# Altium project MedidorTelemetr.PrjPcb
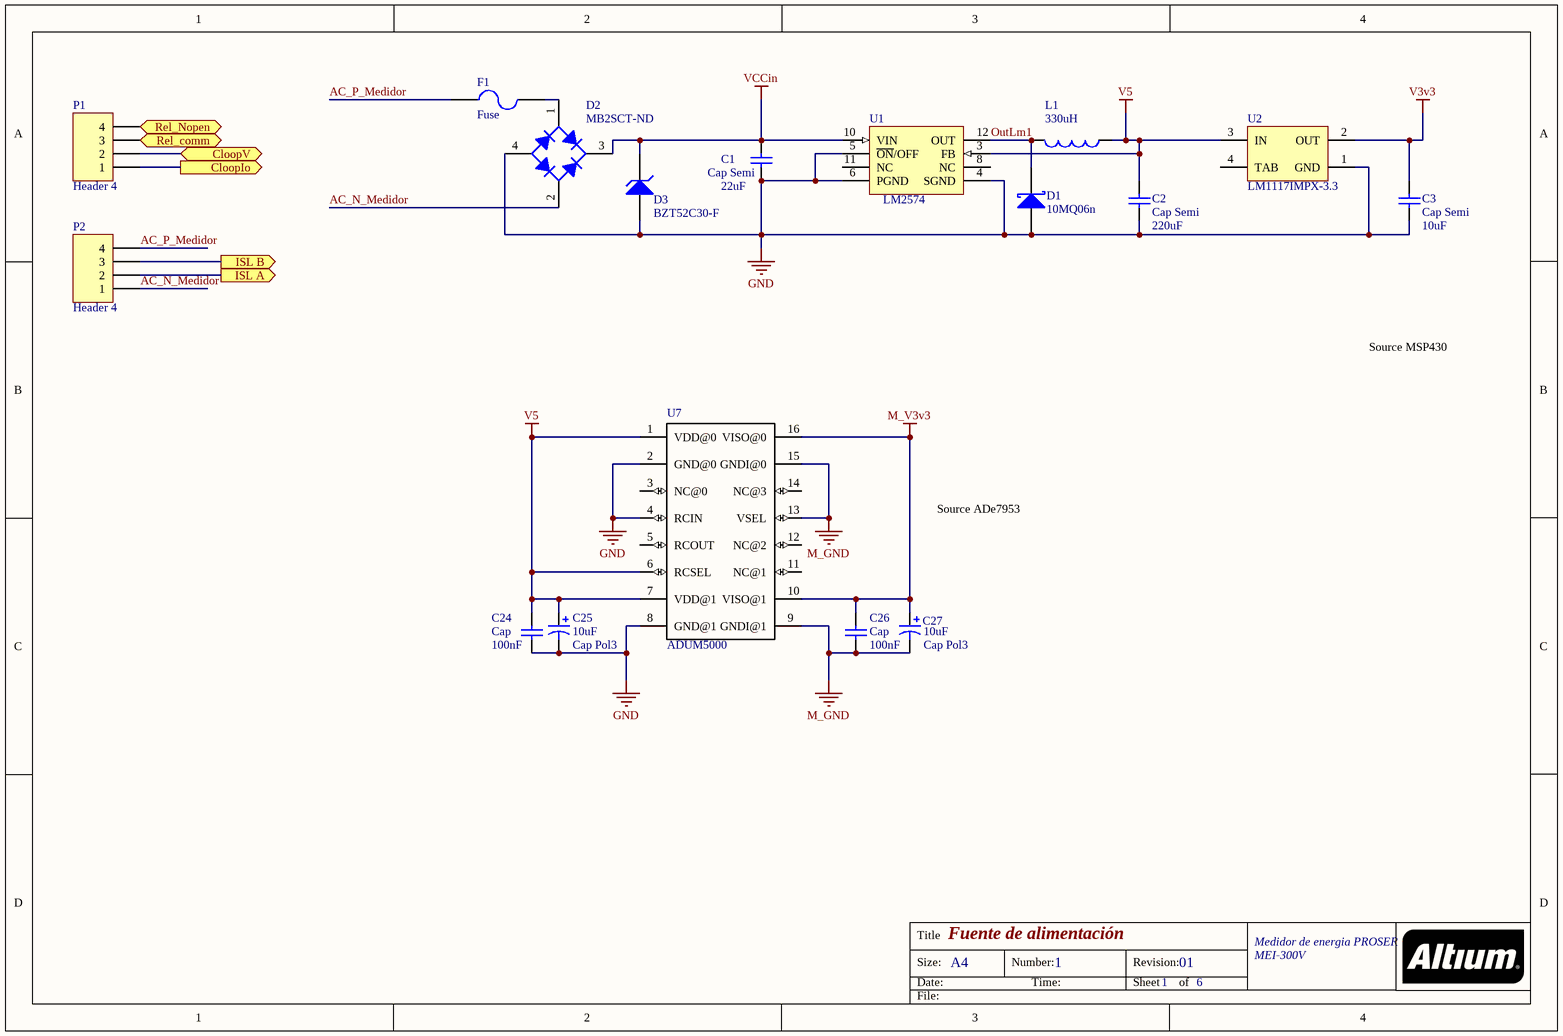
[diagram p0: Alimentacion.SchDoc]
6 sheets, 105 parts. Net scope: flat (ports and power ports of the same name join across sheets).
Board file: PCBenDIM.PcbDoc
Sheets:
  Alimentacion.SchDoc
  Micro.SchDoc
  CircuitoMedidorADE.SchDoc
  ParteAnalogicaMedicion.SchDoc
  comms.SchDoc
  Relay y salida analógica.SchDoc

## Sheet Alimentacion.SchDoc: Fuente de alimentación
size A4; Address1: Medidor de energia PROSER; Address2: MEI-300V; DocumentNumber: 1; Revision: 01; SheetNumber: 1; SheetTotal: 6

### Parts
C1  Cap Semi  value 22uF  [7343]
C2  Cap Semi  value 220uF  [7343]
C3  Cap Semi  value 10uF  [3528]
C24  Cap  value 100nF  [Custom0805]
C25  Cap Pol3  value 10uF  [3528]
C26  Cap  value 100nF  [Custom0805]
C27  Cap Pol3  value 10uF  [3528]
D1  10MQ06n  [DO214]
D2  MB2SCT-ND  [SOIC4_M]
D3  BZT52C30-F  [1N4148W]
F1  Fuse  [SMD030F]
L1  value 330uH  [PE-526XXNL]  (hidden comment: Inductor)
P1  Header 4  [ConectorPrsr]
P2  Header 4  [ConectorPrsr]
U1  LM2574  [SOIC127P1033X264-14N]
U2  LM1117IMPX-3.3  [MP04A_N]
U7  ADUM5000  [*SO16W]

### Ports
CloopIo (out), CloopV, ISL A (out), ISL B (out), Rel_comm (out), Rel_Nopen (out)

### Nets
GND: C1.1 C2.1 C3.1 C24.1 C25.2 D1.1(A) D2.4(A) D3.1(A) U1.4(SGND) U1.5(~{ON}/OFF) U1.6(PGND) U2.1(GND) U7.2(GND@0) U7.4(RCIN) U7.8(GND@1)
M_GND: C26.1 C27.2 U7.9(GNDI@1) U7.13(VSEL) U7.15(GNDI@0)
M_V3v3: C26.2 C27.1 U7.10(VISO@1) U7.16(VISO@0)
V3v3: C3.2 U2.2(OUT)
V5: C2.2 C24.2 C25.1 L1.1 U1.3(FB) U2.3(IN) U7.1(VDD@0) U7.6(RCSEL) U7.7(VDD@1)
VCCin: C1.2 D2.3(K) D3.2(K) U1.10(VIN)
AC_N_Medidor: D2.2(C) P2.1
AC_P_Medidor: F1.1 P2.4
ISL_A: P2.2 ; port ISL A
ISL_B: P2.3 ; port ISL B
OutLm1: D1.2(K) L1.2 U1.12(OUT)
Sal3: P1.2 ; port CloopV
Sal4: P1.1 ; port CloopIo
NetD2_1: D2.1(C) F1.2
NetP1_3: P1.3 ; port Rel_comm
NetP1_4: P1.4 ; port Rel_Nopen

Not connected (* = marked no-connect by the designer): U1 8(NC) 11(NC); U2 4(TAB); U7 3(NC@0) 5(RCOUT) 11(NC@1) 12(NC@2) 14(NC@3)

### Notes on the sheet
- Source MSP430
- Source ADe7953
- Title
- Size:
- Date:
- A4
- Number:
- Time:
- Revision:
- Sheet
- of
- File:

### Library data of the parts
C1-C3 = Cap Semi: Capacitor (Semiconductor SIM Model); Published: 8-Jun-2000; LatestRevisionDate: 29-May-2009; LatestRevisionNote: IPC-7351 Footprint Added.; PackageReference: C1206; Publisher: Altium Limited; PackageDescription: Chip Capacitor
C24 C26 = Cap: Capacitor; Published: 8-Jun-2000; LatestRevisionDate: 17-Jul-2002; LatestRevisionNote: Re-released for DXP Platform.; PackageReference: RAD-0.3; Publisher: Altium Limited; PackageDescription: Radial Cap, Thru-Hole; 2 Leads; 0.3 in Pin Spacing
C25 C27 = Cap Pol3: Polarized Capacitor (Surface Mount); Published: 8-Jun-2000; LatestRevisionDate: 29-May-2009; LatestRevisionNote: IPC-7351 Footprint Added.; PackageReference: C0805; Publisher: Altium Limited; PackageDescription: Chip Capacitor
D1 = D Schottky: Schottky Diode; Published: 8-Jun-2000; LatestRevisionDate: 17-Jul-2002; LatestRevisionNote: Re-released for DXP Platform.; PackageReference: SMB; Publisher: Altium Limited; PackageDescription: DO-214-AA/SMB; 2 C-Bend Leads; Body 5.3 x 3.6 mm, inc. leads (LxW); Code_JEDEC: DO-214-AA
D2 = Bridge1: Full Wave Diode Bridge - MB2S; Published: 8-Jun-2000; LatestRevisionDate: 29-May-2009; LatestRevisionNote: Sch pins A & K swapped.; DatasheetVersion: E2732B; PackageReference: D-38; Publisher: Altium Limited; PackageDescription: Bridge Rectifier; 4 Terminals; Body 9.4 x 9.4 mm (typ); Pitch 5.08 mm
D3 = D Zener: Zener Diode SMD; Published: 8-Jun-2000; LatestRevisionDate: 17-Jul-2002; LatestRevisionNote: Re-released for DXP Platform.; PackageReference: DIODE-0.7; Publisher: Altium Limited; PackageDescription: Diode, Thru-Hole; 2 Leads; 0.7 in Pin Spacing
F1 = Fuse 2: SMD030-2CT-ND; Published: 8-Jun-2000; LatestRevisionDate: 17-Jul-2002; LatestRevisionNote: Re-released for DXP Platform.; PackageReference: PIN-W2/E2.8; Publisher: Altium Limited; PackageDescription: Thru-Hole; 2 Leads
L1 = Inductor: PE52627NL; Code_IEC: 1005; Published: 8-Jun-2000; LatestRevisionDate: 29-May-2009; LatestRevisionNote: IPC-7351 Footprint Added.; PackageReference: 0402-A; Publisher: Altium Limited; PackageDescription: Chip Inductor; Code_JEITA: 0402
P1 P2 = Header 4: Header, 4-Pin; LatestRevisionDate: 17-Jul-2002; LatestRevisionNote: Re-released for DXP Platform.; Publisher: Altium Limited
U1 = LM2574N-5: Easy Switcher 0.5A Step-Down Voltage Regulator; Published: 15-Apr-2002; DatasheetVersion: Jul-1999; PackageVersion: 1998; PackageReference: 626-05; Publisher: Altium Limited; PackageDescription: DIP; 8 Leads; Row Spacing 7.62 mm; Pitch 2.54 mm; ComponentLink1Description: Manufacturer Link; ComponentLink1URL: http://www.onsemi.com/site/products/taxonomy/0,4438,503,00.html; ComponentLink2Description: Datasheet; ComponentLink2URL: http://www.onsemi.com/pub/Collateral/LM2574-D.PDF
U2 = LM1117IMPX-3.3: 800mA Low-Dropout Linear Regulator, 4-pin SOT-223; Manufacturer: National Semiconductor; PackageTopMarking: XYTT*N05B; PowerWise: N; CompType: LDO IC; Published: 1-Mar-2010; DatasheetVersion: Apr-2006; PackageVersion: revB, Apr-2003; PackageReference: MP04A; Publisher: Altium Limited; PackageDescription: Molded SOT-223, 6.50 x 3.56 x 1.6mm Body, 4 Lead, 2.3mm Pitch; PartNumber: LM1117IMPX-3.3; RoHS: N; PinCount: 4; Code_JEDEC: TO-261-AA; Code_IPC: SOT223-4; ComponentLink1Description: LM1117 Datasheet; ComponentLink1URL: http://www.national.com/ds/LM/LM1117.pdf; ComponentLink2Description: LM1117 Web Page; ComponentLink2URL: http://www.national.com/pf/LM/LM1117.html; ComponentLink3Description: MP04A Package Page; ComponentLink3URL: http://www.national.com/packaging/folders/mp04a.html
U7 = ADUM5000: ADI Isolated DC/DC Converter; MF: Analog Devices; SnapEDA_Link: https://www.snapeda.com/parts/ADUM5000/Analog%20Devices%20Inc./view-part/?ref=snap; Price: None; Availability: Unavailable; MP: ADUM5000; Package: None; Value: *

## Sheet Micro.SchDoc: Microcontrolador MSP430F2618
size A4; Address1: Medidor de energia PROSER; Address2: MEI-300V; DocumentNumber: 2; Revision: 01; SheetNumber: 2; SheetTotal: 6
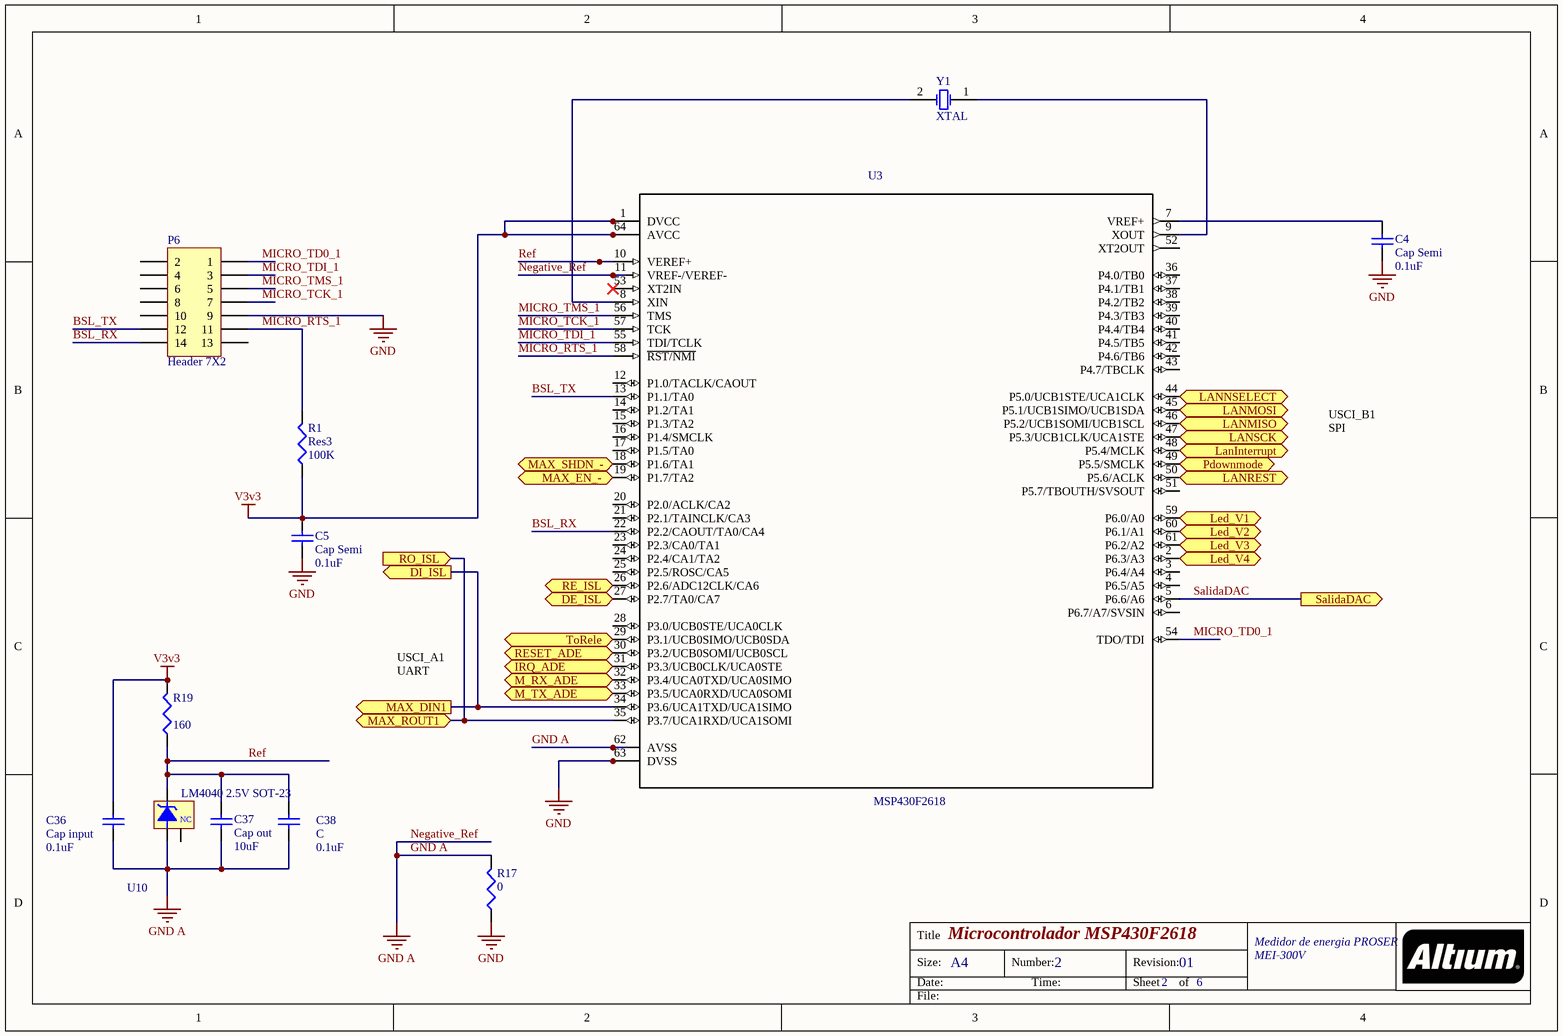
[diagram p1: Micro.SchDoc]

### Parts
C4  Cap Semi  value 0.1uF  [Custom0805]
C5  Cap Semi  value 0.1uF  [Custom0805]
C36  Cap input  value 0.1uF  [CUSTOM0805]
C37  Cap out  value 10uF  [TC6032-2412]
C38  C  value 0.1uF  [Custom0805]
P6  Header 7X2  [HDR2X7]
R1  Res3  value 100K  [Custom0805]
R17  value 0  [Custom0805]  (hidden comment: Res3)
R19  value 160  [Custom0805]  (hidden comment: Res3)
U3  MSP430F2618  [QFP50P1200X1200X160-64N]
U10  LM4040 2.5V SOT-23  [SOT23_M]
Y1  XTAL  [XTAL1140X475X430D1315L440X63M]

### Ports
DE_ISL (out), DI_ISL (out), IRQ_ADE (in), LanInterrupt (in), LANMISO (in), LANMOSI (out), LANNSELECT (out), LANREST (out), LANSCK (out), Led_V1 (out), Led_V2 (out), Led_V3 (out), Led_V4 (out), M_RX_ADE (out), M_TX_ADE (in), MAX_DIN1 (out), MAX_EN_- (out), MAX_ROUT1, MAX_SHDN_- (out), Pdownmode (out), RE_ISL (out), RESET_ADE (out), RO_ISL (in), SalidaDAC (out), ToRele (out)

### Nets
GND: C4.1 C5.1 P6.9 R17.1 U3.63(DVSS)
GND A: C36.1 C37.1 C38.1 R17.2 U3.11(VREF-/VEREF-) U3.62(AVSS) U10.2(A)  [also labelled Negative_Ref]
V3v3: C5.2 C36.2 R1.1 R19.2 U3.1(DVCC) U3.64(AVCC)
BSL_RX: P6.14 U3.22(P2.2/CAOUT/TA0/CA4)
BSL_TX: P6.12 U3.13(P1.1/TA0)
MICRO_RTS_1: P6.11 R1.2 U3.58(~{RST/NMI})
MICRO_TCK_1: P6.7 U3.57(TCK)
MICRO_TD0_1: P6.1 U3.54(TDO/TDI)
MICRO_TDI_1: P6.3 U3.55(TDI/TCLK)
MICRO_TMS_1: P6.5 U3.56(TMS)
Ref: C37.2 C38.2 R19.1 U3.10(VEREF+) U10.1(K)
SalidaDAC: U3.5(P6.6/A6) ; port SalidaDAC
NetC4_2: C4.2 U3.7(VREF+)
NetEth1_3: U3.45(P5.1/UCB1SIMO/UCB1SDA) ; port LANMOSI
NetEth1_4: U3.47(P5.3/UCB1CLK/UCA1STE) ; port LANSCK
NetEth1_5: U3.44(P5.0/UCB1STE/UCA1CLK) ; port LANNSELECT
NetEth1_6: U3.48(P5.4/MCLK) ; port LanInterrupt
NetEth1_10: U3.49(P5.5/SMCLK) ; port Pdownmode
NetEth1_11: U3.50(P5.6/ACLK) ; port LANREST
NetEth1_12: U3.46(P5.2/UCB1SOMI/UCB1SCL) ; port LANMISO
NetR3_2: U3.35(P3.7/UCA1RXD/UCA1SOMI) ; port RO_ISL, port MAX_ROUT1
NetR22_1: U3.29(P3.1/UCB0SIMO/UCB0SDA) ; port ToRele
NetU3_2: U3.2(P6.3/A3) ; port Led_V4
NetU3_8: U3.8(XIN) Y1.2(OSC2)
NetU3_9: U3.9(XOUT) Y1.1(OSC1)
NetU3_18: U3.18(P1.6/TA1) ; port MAX_SHDN_-
NetU3_19: U3.19(P1.7/TA2) ; port MAX_EN_-
NetU3_26: U3.26(P2.6/ADC12CLK/CA6) ; port RE_ISL
NetU3_27: U3.27(P2.7/TA0/CA7) ; port DE_ISL
NetU3_30: U3.30(P3.2/UCB0SOMI/UCB0SCL) ; port RESET_ADE
NetU3_31: U3.31(P3.3/UCB0CLK/UCA0STE) ; port IRQ_ADE
NetU3_32: U3.32(P3.4/UCA0TXD/UCA0SIMO) ; port M_RX_ADE
NetU3_33: U3.33(P3.5/UCA0RXD/UCA0SOMI) ; port M_TX_ADE
NetU3_34: U3.34(P3.6/UCA1TXD/UCA1SIMO) ; port DI_ISL, port MAX_DIN1
NetU3_59: U3.59(P6.0/A0) ; port Led_V1
NetU3_60: U3.60(P6.1/A1) ; port Led_V2
NetU3_61: U3.61(P6.2/A2) ; port Led_V3

Not connected (* = marked no-connect by the designer): P6 2 4 6 8 10 13; U3 3(P6.4/A4) 4(P6.5/A5) 6(P6.7/A7/SVSIN) 12(P1.0/TACLK/CAOUT) 14(P1.2/TA1) 15(P1.3/TA2) 16(P1.4/SMCLK) 17(P1.5/TA0) 20(P2.0/ACLK/CA2) 21(P2.1/TAINCLK/CA3) 23(P2.3/CA0/TA1) 24(P2.4/CA1/TA2) 25(P2.5/ROSC/CA5) 28(P3.0/UCB0STE/UCA0CLK) 36(P4.0/TB0) 37(P4.1/TB1) 38(P4.2/TB2) 39(P4.3/TB3) 40(P4.4/TB4) 41(P4.5/TB5) 42(P4.6/TB6) 43(P4.7/TBCLK) 51(P5.7/TBOUTH/SVSOUT) 52(XT2OUT) 53(XT2IN)*; U10 3(NC)

### Notes on the sheet
- USCI_B1
  SPI
- USCI_A1
  UART
- Title
- Size:
- Date:
- A4
- Number:
- Time:
- Revision:
- Sheet
- of
- File:

### Library data of the parts
C4 C5 C36-C38 = Cap Semi: Capacitor (Semiconductor SIM Model); Published: 8-Jun-2000; LatestRevisionDate: 29-May-2009; LatestRevisionNote: IPC-7351 Footprint Added.; PackageReference: C1206; Publisher: Altium Limited; PackageDescription: Chip Capacitor
P6 = Header 7X2: Header, 7-Pin, Dual row; LatestRevisionDate: 17-Jul-2002; LatestRevisionNote: Re-released for DXP Platform.; Publisher: Altium Limited
R1 R17 R19 = Res3: Resistor; Published: 8-Jun-2000; LatestRevisionDate: 29-May-2009; LatestRevisionNote: IPC-7351 Footprint Added.; PackageReference: J1-0603; Publisher: Altium Limited; PackageDescription: Chip Resistor
U3 = MSP430F2410TPMR: 16-bit Ultra-Low-Power Microcontroller, 56KB Flash, 4KB RAM, 12-Bit ADC, 2 USCIs, HW Multiplier 64-LQFP -40 to 105; MF: Texas Instruments; Package: LQFP-64 Texas Instruments; Price: None; SnapEDA_Link: https://www.snapeda.com/parts/MSP430F2410TPMR/Texas%20Instruments/view-part/?ref=snap; Availability: Unavailable; MP: MSP430F2410TPMR; Value: *
U10 = LM185LD-2.5: Micropower Voltage Reference; Note: Anode (pin 3) is in electrical contact with the case.; Published: 15-Apr-2002; DatasheetVersion: Jan-1989; PackageVersion: 1989; PackageReference: LD003; Publisher: Altium Limited; PackageDescription: Can; 3 Leads; Pin Circle Dia. 2.54 mm; Lead Dia. 0.48 mm (max); ComponentLink1Description: Manufacturer Link; ComponentLink1URL: http://www.ti.com/
Y1 = XTAL: Crystal Oscillator; Published: 8-Jun-2000; LatestRevisionDate: 17-Jul-2002; LatestRevisionNote: Re-released for DXP Platform.; PackageReference: R38; Publisher: Altium Limited; PackageDescription: Crystal, Thru-Hole; 2 Leads; Body 3.1 x 8.2 mm (Dia.xH)

## Sheet CircuitoMedidorADE.SchDoc: ADE7953
size A4; Address1: Medidor de energia PROSER; Address2: MEI-300V; DocumentNumber: 3; Revision: 01; SheetNumber: 3; SheetTotal: 6
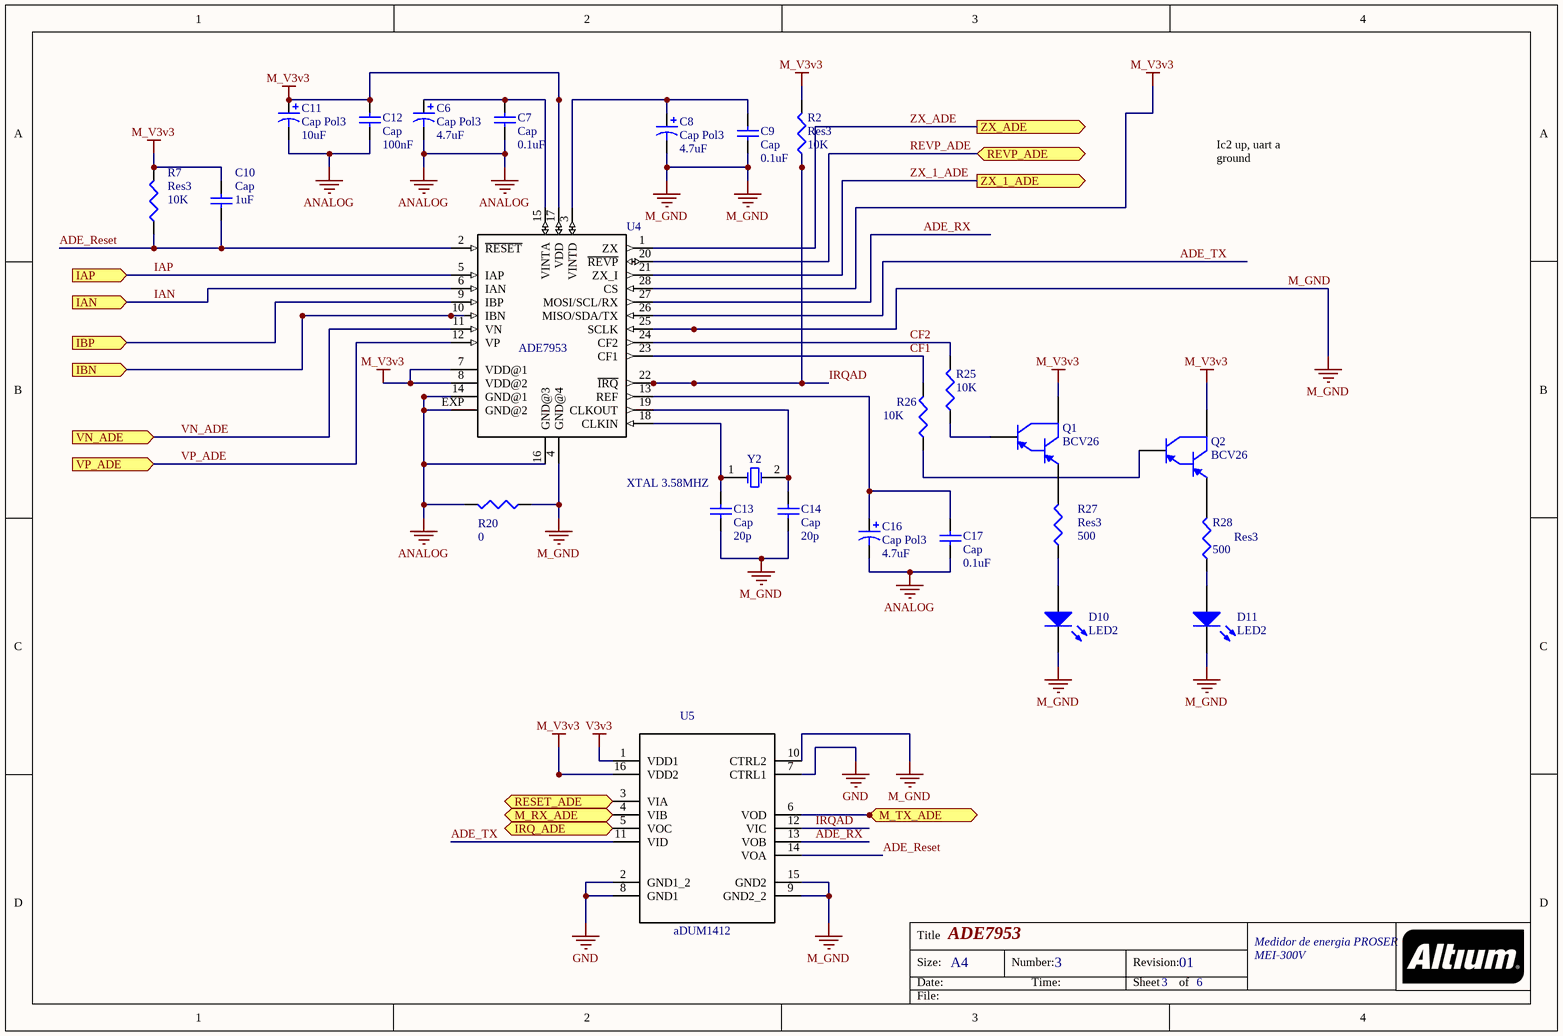
[diagram p2: CircuitoMedidorADE.SchDoc]

### Parts
C6  Cap Pol3  value 4.7uF  [Custom0805]
C7  Cap  value 0.1uF  [Custom0805]
C8  Cap Pol3  value 4.7uF  [Custom0805]
C9  Cap  value 0.1uF  [Custom0805]
C10  Cap  value 1uF  [Custom0805]
C11  Cap Pol3  value 10uF  [Custom0805]
C12  Cap  value 100nF  [Custom0805]
C13  Cap  value 20p  [Custom0805]
C14  Cap  value 20p  [Custom0805]
C16  Cap Pol3  value 4.7uF  [Custom0805]
C17  Cap  value 0.1uF  [Custom0805]
D10  LED2  [Custom0805]
D11  LED2  [Custom0805]
Q1  BCV26  [SOT23_L]
Q2  BCV26  [SOT23_L]
R2  Res3  value 10K  [Custom0805]
R7  Res3  value 10K  [Custom0805]
R20  value 0  [Custom0805]  (hidden comment: Res3)
R25  value 10K  [Custom0805]  (hidden comment: Rb)
R26  value 10K  [Custom0805]  (hidden comment: Rb)
R27  Res3  value 500  [Custom0805]
R28  Res3  value 500  [Custom0805]
U4  ADE7953  [*LFCSP28_ADE7953(Primary)]
U5  aDUM1412  [*SOIC127P1032X265-16N]
Y2  XTAL 3.58MHZ  [XTAL1140X475X430D1315L440X63M]

### Ports
IAN (in), IAP (in), IBN (in), IBP (in), IRQ_ADE (out), M_RX_ADE (in), M_TX_ADE (out), RESET_ADE (in), REVP_ADE (bidir), VN_ADE (in), VP_ADE (in), ZX_1_ADE (out), ZX_ADE (out)

### Nets
ANALOG: C6.2 C7.1 C11.2 C12.1 C16.2 C17.1 R20.2 U4.14(GND@1) U4.16(GND@3) U4.EXP(GND@2)
GND: U5.2(GND1_2) U5.7(CTRL1) U5.8(GND1)
M_GND: C8.2 C9.1 C13.1 C14.1 D10.2(K) D11.2(K) R20.1 U4.4(GND@4) U4.25(SCLK) U5.9(GND2_2) U5.10(CTRL2) U5.15(GND2)
M_V3v3: C10.2 C11.1 C12.2 Q1.3(C) Q2.3(C) R2.2 R7.2 U4.7(VDD@1) U4.8(VDD@2) U4.17(VDD) U4.28(CS) U5.16(VDD2)
V3v3: U5.1(VDD1)
ADE_Reset: C10.1 R7.1 U4.2(~{RESET}) U5.14(VOA)
ADE_RX: U4.27(MOSI/SCL/RX) U5.13(VOB)
ADE_TX: U4.26(MISO/SDA/TX) U5.11(VID)
CF1: R26.2 U4.23(CF1)
CF2: R25.2 U4.24(CF2)
IAN: U4.6(IAN) ; port IAN
IAP: U4.5(IAP) ; port IAP
IRQAD: R2.1 U4.22(~{IRQ}) U5.12(VIC)
REVP_ADE: U4.20(~{REVP}) ; port REVP_ADE
VN_ADE: U4.11(VN) ; port VN_ADE
VP_ADE: U4.12(VP) ; port VP_ADE
ZX_1_ADE: U4.21(ZX_I) ; port ZX_1_ADE
ZX_ADE: U4.1(ZX) ; port ZX_ADE
NetC6_1: C6.1 C7.2 U4.15(VINTA)
NetC8_1: C8.1 C9.2 U4.3(VINTD)
NetC13_2: C13.2 U4.18(CLKIN) Y2.1(OSC1)
NetC14_2: C14.2 U4.19(CLKOUT) Y2.2(OSC2)
NetC16_1: C16.1 C17.2 U4.13(REF)
NetD10_1: D10.1(A) R27.1
NetD11_1: D11.1(A) R28.1
NetQ1_1: Q1.1(E) R27.2
NetQ1_2: Q1.2(B) R25.1
NetQ2_1: Q2.1(E) R28.2
NetQ2_2: Q2.2(B) R26.1
NetU3_30: U5.3(VIA) ; port RESET_ADE
NetU3_31: U5.5(VOC) ; port IRQ_ADE
NetU3_32: U5.4(VIB) ; port M_RX_ADE
NetU3_33: U5.6(VOD) ; port M_TX_ADE
NetU4_9: U4.9(IBP) ; port IBP
NetU4_10: U4.10(IBN) ; port IBN

### Notes on the sheet
- Ic2 up, uart a ground
- Title
- Size:
- Date:
- A4
- Number:
- Time:
- Revision:
- Sheet
- of
- File:

### Library data of the parts
C6 C8 C11 C16 = Cap Pol3: Polarized Capacitor (Surface Mount); Published: 8-Jun-2000; LatestRevisionDate: 29-May-2009; LatestRevisionNote: IPC-7351 Footprint Added.; PackageReference: C0805; Publisher: Altium Limited; PackageDescription: Chip Capacitor
C7 C9 C10 C12-C14 C17 = Cap: Capacitor; Published: 8-Jun-2000; LatestRevisionDate: 17-Jul-2002; LatestRevisionNote: Re-released for DXP Platform.; PackageReference: RAD-0.3; Publisher: Altium Limited; PackageDescription: Radial Cap, Thru-Hole; 2 Leads; 0.3 in Pin Spacing
D10 D11 = LED2: Typical RED, GREEN, YELLOW, AMBER GaAs LED; Published: 8-Jun-2000; LatestRevisionDate: 17-Jul-2002; LatestRevisionNote: Re-released for DXP Platform.; PackageVersion: Feb-2002; PackageReference: 3.2X1.6X1.1; Publisher: Altium Limited; PackageDescription: SM LED; 2 Flat Leads
Q1 Q2 = PNP1: PNP Darlington Bipolar Transistor; Published: 8-Jun-2000; LatestRevisionDate: 17-Jul-2002; LatestRevisionNote: Re-released for DXP Platform.; DatasheetVersion: May-1994; PackageVersion: 1995/1996; PackageReference: E3; Publisher: Altium Limited; PackageDescription: TO, Flat Index; 3 In-Line, Axial Leads; Body Dia. 4.6mm; Lead Dia. 0.5 mm (max); ComponentLink1Description: Manufacturer Link; ComponentLink1URL: http://www.zetex.com/
R2 R7 R20 R25-R28 = Res3: Resistor; Published: 8-Jun-2000; LatestRevisionDate: 29-May-2009; LatestRevisionNote: IPC-7351 Footprint Added.; PackageReference: J1-0603; Publisher: Altium Limited; PackageDescription: Chip Resistor
U4 = ADE7953: MF: Analog Devices; Availability: Unavailable; Price: None; MP: ADE7953; Package: None; SnapEDA_Link: https://www.snapeda.com/parts/ADE7953/Analog%20Devices/view-part/?ref=snap; Value: *
U5 = ADUM1411ARWZ-RL: Digital Isolator CMOS 4-CH 1Mbps 16-Pin SOIC W T/R; MF: Analog Devices; Package: SOIC-16 Analog Devices; Availability: Unavailable; MP: ADUM1411ARWZ-RL; SnapEDA_Link: https://www.snapeda.com/parts/ADUM1411ARWZ-RL/Analog%20Devices%20Inc./view-part/?ref=snap; Price: None; Value: *
Y2 = XTAL: Crystal Oscillator; Published: 8-Jun-2000; LatestRevisionDate: 17-Jul-2002; LatestRevisionNote: Re-released for DXP Platform.; PackageReference: R38; Publisher: Altium Limited; PackageDescription: Crystal, Thru-Hole; 2 Leads; Body 3.1 x 8.2 mm (Dia.xH)

## Sheet ParteAnalogicaMedicion.SchDoc: Etapa de entrada alterna
size A4; Address1: Medidor de energia PROSER; Address2: MEI-300V; DocumentNumber: 4; Revision: 01; SheetNumber: 4; SheetTotal: 6
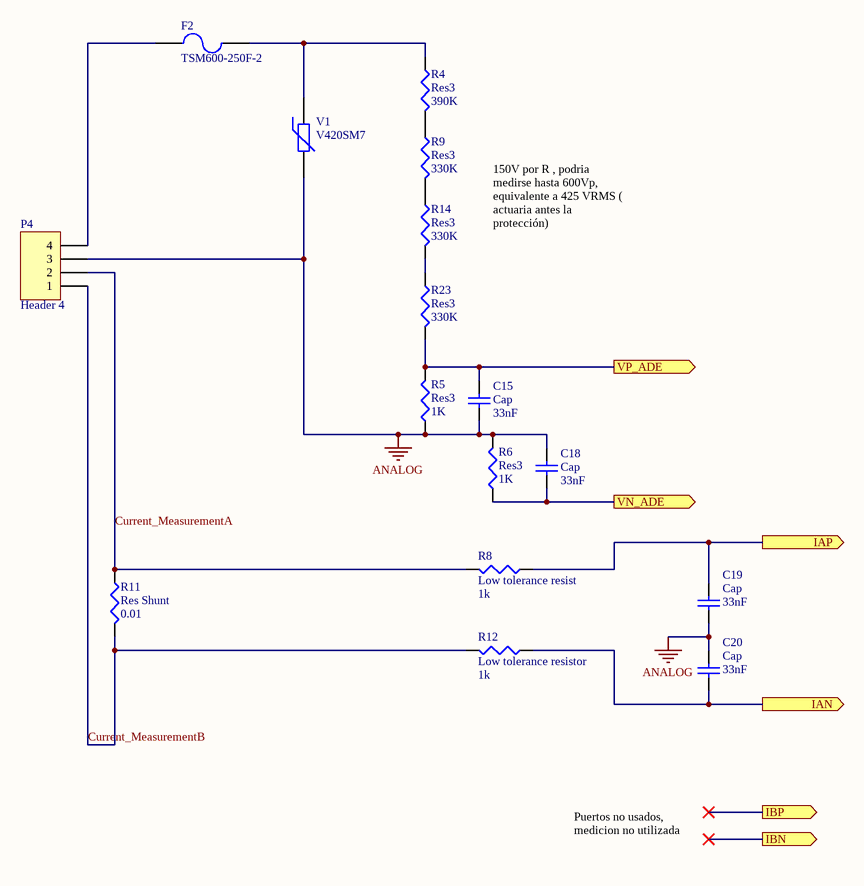
[diagram p3: ParteAnalogicaMedicion.SchDoc]

### Parts
C15  Cap  value 33nF  [Custom0805]
C18  Cap  value 33nF  [Custom0805]
C19  Cap  value 33nF  [Custom0805]
C20  Cap  value 33nF  [Custom0805]
F2  TSM600-250F-2  [*SOIC254P1016X440-4N]
P4  Header 4  [ConectorPrsr]
R4  Res3  value 390K  [Custom0805]
R5  Res3  value 1K  [Custom0805]
R6  Res3  value 1K  [Custom0805]
R8  Low tolerance resist  value 1k  [Custom0805]
R9  Res3  value 330K  [Custom0805]
R11  Res Shunt  value 0.01  [RESC1000X525X52L180M]
R12  Low tolerance resistor  value 1k  [Custom0805]
R14  Res3  value 330K  [Custom0805]
R23  Res3  value 330K  [C0805]
V1  V420SM7  [PCBComponent_1]

### Ports
IAN (out), IAP (out), IBN (out), IBP (out), VN_ADE (out), VP_ADE (out)

### Nets
ANALOG: C15.1 C18.2 C19.1 C20.2 P4.3 R5.1 R6.2 V1.2
Current_MeasurementA: P4.2 R8.2 R11.1
Current_MeasurementB: P4.1 R11.2 R12.2
IAN: C20.1 R12.1 ; port IAN
IAP: C19.2 R8.1 ; port IAP
VN_ADE: C18.1 R6.1 ; port VN_ADE
VP_ADE: C15.2 R5.2 R23.2 ; port VP_ADE
NetF2_1: F2.1 P4.4
NetF2_2: F2.2 R4.1 V1.1
NetR4_2: R4.2 R9.1
NetR9_2: R9.2 R14.1
NetR14_2: R14.2 R23.1

### Notes on the sheet
- 150V por R , podria medirse hasta 600Vp, equivalente a 425 VRMS ( actuaria antes la protección)
- Puertos no usados, medicion no utilizada
- Title
- Size:
- Date:
- A4
- Number:
- Time:
- Revision:
- Sheet
- of
- File:

### Library data of the parts
C15 C18-C20 = Cap: Capacitor; Published: 8-Jun-2000; LatestRevisionDate: 17-Jul-2002; LatestRevisionNote: Re-released for DXP Platform.; PackageReference: RAD-0.3; Publisher: Altium Limited; PackageDescription: Radial Cap, Thru-Hole; 2 Leads; 0.3 in Pin Spacing
F2 = Fuse 2: Fuse; Published: 8-Jun-2000; LatestRevisionDate: 17-Jul-2002; LatestRevisionNote: Re-released for DXP Platform.; PackageReference: PIN-W2/E2.8; Publisher: Altium Limited; PackageDescription: Thru-Hole; 2 Leads
P4 = Header 4: Header, 4-Pin; LatestRevisionDate: 17-Jul-2002; LatestRevisionNote: Re-released for DXP Platform.; Publisher: Altium Limited
R4-R6 R8 R9 R11 R12 R14 R23 = Res3: Resistor; Published: 8-Jun-2000; LatestRevisionDate: 29-May-2009; LatestRevisionNote: IPC-7351 Footprint Added.; PackageReference: J1-0603; Publisher: Altium Limited; PackageDescription: Chip Resistor
V1 = Res Varistor: Varistor (Voltage-Sensitive Resistor); Published: 24-Mar-1999; LatestRevisionDate: 29-May-2009; LatestRevisionNote: IPC-7351 Footprint Added.; PackageVersion: Mar-2003; PackageReference: 6-0805; Publisher: Altium Limited; PackageDescription: Chip Resistor 0805 Case Size; Code_IPC: RESC2012

## Sheet comms.SchDoc: Interfaz de comunicación
size A4; Address1: Medidor de energia PROSER; Address2: MEI-300V; DocumentNumber: 5; Revision: 01; SheetNumber: 5; SheetTotal: 6
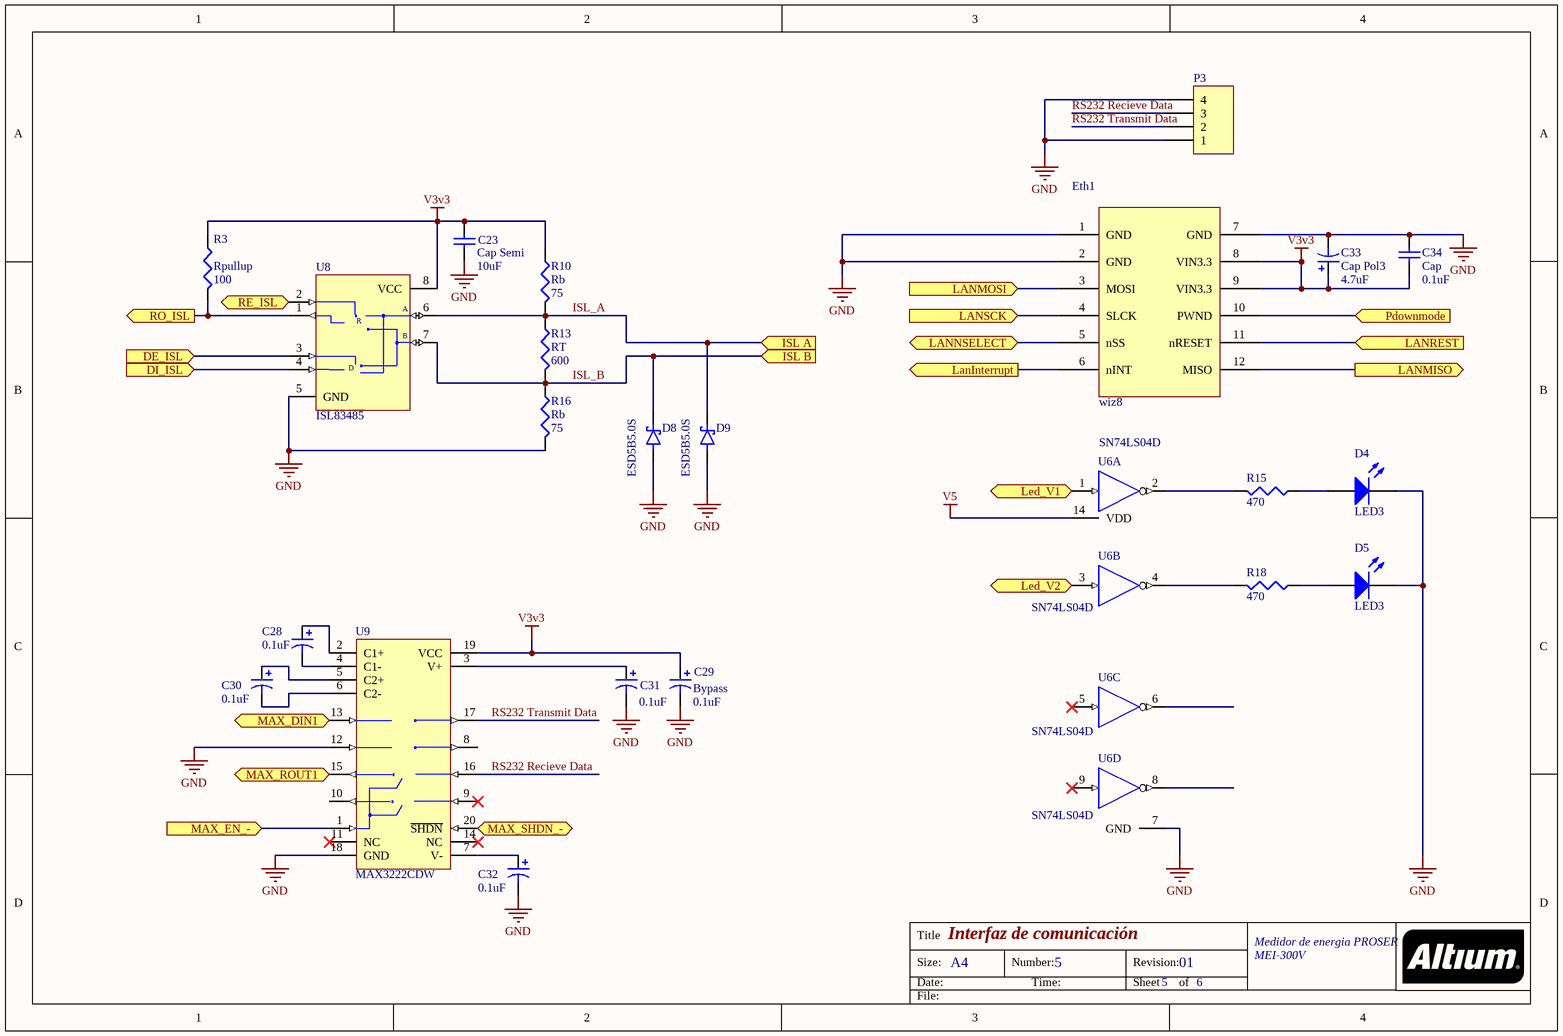
[diagram p4: comms.SchDoc]

### Parts
C23  Cap Semi  value 10uF  [Custom0805]
C28  value 0.1uF  [Custom0805]  (hidden comment: C Pol)
C29  Bypass  value 0.1uF  [Custom0805]
C30  value 0.1uF  [Custom0805]  (hidden comment: C Pol)
C31  value 0.1uF  [Custom0805]  (hidden comment: C Pol)
C32  value 0.1uF  [Custom0805]  (hidden comment: C Pol)
C33  Cap Pol3  value 4.7uF  [Custom0805]
C34  Cap  value 0.1uF  [Custom0805]
D4  LED3  [*0603]
D5  LED3  [*0603]
D8  ESD5B5.0S  [DIO_XBS053V15R-G]
D9  ESD5B5.0S  [DIO_XBS053V15R-G]
Eth1  wiz8  [wiz8]
P3  Header 4  [ConectorPrsr]  (value not drawn)
R3  Rpullup  value 100  [Custom0805]
R10  Rb  value 75  [Custom0805]
R13  RT  value 600  [Custom0805]
R15  value 470  [Custom0805]  (hidden comment: Res3)
R16  Rb  value 75  [Custom0805]
R18  value 470  [Custom0805]  (hidden comment: Res3)
U6  SN74LS04D  [751A-03_N]  (parts A,B,C,D of 6)
U8  ISL83485  [SO8_M]
U9  MAX3222CDW  [SOIC20_N]

### Ports
DE_ISL (in), DI_ISL (in), ISL A (in), ISL B (in), LanInterrupt (out), LANMISO (out), LANMOSI (in), LANNSELECT, LANREST (in), LANSCK (in), Led_V1 (in), Led_V2 (in), MAX_DIN1 (in), MAX_EN_- (in), MAX_ROUT1 (out), MAX_SHDN_- (in), Pdownmode (in), RE_ISL (in), RO_ISL (out)

### Nets
GND: C23.1 C29.2 C31.2 C32.2 C33.2 C34.2 D4.2(K) D5.2(K) D8.A D9.A Eth1.1(GND) Eth1.2(GND) Eth1.7(GND) P3.1 P3.4 R16.2 U6.7(GND) U8.5(GND) U9.12(T2IN) U9.18(GND)
V3v3: C23.2 C29.1 C33.1 C34.1 Eth1.8(VIN3.3) Eth1.9(VIN3.3) R3.1 R10.1 U8.8(VCC) U9.19(VCC)
V5: U6.14(VDD)
ISL_A: D9.C(K) R10.2 R13.1 U8.6(A) ; port ISL A
ISL_B: D8.C(K) R13.2 R16.1 U8.7(B) ; port ISL B
RS232 Recieve Data: P3.3 U9.16(R1IN)
RS232 Transmit Data: P3.2 U9.17(T1OUT)
NetC28_1: C28.1 U9.2(C1+)
NetC28_2: C28.2 U9.4(C1-)
NetC30_1: C30.1 U9.5(C2+)
NetC30_2: C30.2 U9.6(C2-)
NetC31_1: C31.1 U9.3(V+)
NetC32_1: C32.1 U9.7(V-)
NetD4_1: D4.1(A) R15.1
NetD5_1: D5.1(A) R18.1
NetEth1_3: Eth1.3(MOSI) ; port LANMOSI
NetEth1_4: Eth1.4(SLCK) ; port LANSCK
NetEth1_5: Eth1.5(nSS) ; port LANNSELECT
NetEth1_6: Eth1.6(nINT) ; port LanInterrupt
NetEth1_10: Eth1.10(PWND) ; port Pdownmode
NetEth1_11: Eth1.11(nRESET) ; port LANREST
NetEth1_12: Eth1.12(MISO) ; port LANMISO
NetR3_2: R3.2 U8.1(RO) U9.15(R1OUT) ; port RO_ISL, port MAX_ROUT1
NetR15_2: R15.2 U6.2(~{OUT})
NetR18_2: R18.2 U6.4(~{OUT})
NetU3_18: U9.20(~{SHDN}) ; port MAX_SHDN_-
NetU3_19: U9.1(~{EN}) ; port MAX_EN_-
NetU3_26: U8.2(~{RE}) ; port RE_ISL
NetU3_27: U8.3(DE) ; port DE_ISL
NetU3_34: U8.4(DI) U9.13(T1IN) ; port DI_ISL, port MAX_DIN1
NetU3_59: U6.1(IN) ; port Led_V1
NetU3_60: U6.3(IN) ; port Led_V2

Not connected (* = marked no-connect by the designer): U6 5(IN)* 6(~{OUT}) 8(~{OUT}) 9(IN)*; U9 8(T2OUT) 9(R2IN)* 10(R2OUT) 11(NC)* 14(NC)*

### Notes on the sheet
- Title
- Size:
- Date:
- A4
- Number:
- Time:
- Revision:
- Sheet
- of
- File:
- (in symbol MAX485ESA) R; D

### Library data of the parts
C23 = Cap Semi: Capacitor (Semiconductor SIM Model); Published: 8-Jun-2000; LatestRevisionDate: 29-May-2009; LatestRevisionNote: IPC-7351 Footprint Added.; PackageReference: C1206; Publisher: Altium Limited; PackageDescription: Chip Capacitor
C28-C33 = Cap Pol3: Polarized Capacitor (Surface Mount); Published: 8-Jun-2000; LatestRevisionDate: 29-May-2009; LatestRevisionNote: IPC-7351 Footprint Added.; PackageReference: C0805; Publisher: Altium Limited; PackageDescription: Chip Capacitor
C34 = Cap: Capacitor; Published: 8-Jun-2000; LatestRevisionDate: 17-Jul-2002; LatestRevisionNote: Re-released for DXP Platform.; PackageReference: RAD-0.3; Publisher: Altium Limited; PackageDescription: Radial Cap, Thru-Hole; 2 Leads; 0.3 in Pin Spacing
D4 D5 = LED3: Typical BLUE SiC LED; Published: 8-Jun-2000; LatestRevisionDate: 17-Dec-2003; LatestRevisionNote: PCB Footprint replaced.; DatasheetVersion: 16-Apr-2002; PackageVersion: 16-Apr-2002; PackageReference: 3.5X2.8X1.9; Publisher: Altium Limited; PackageDescription: SM LED; 2 C-Bend Leads; Body 3.5 x 2.8 x 1.9 mm, inc leads (LxWxH typ)
D8 D9 = XBS053V15R-G: Diode Schottky 20V 500mA Surface Mount SOD-523; MF: Torex; Value: *; MP: XBS053V15R-G; Package: SOD-523 Torex; SnapEDA_Link: https://www.snapeda.com/parts/XBS053V15R-G/Torex/view-part/808826/?ref=snap; Digi-Key_Part_Number: XBS053V15R-G-ND; Digi-Key_Purchase_URL: https://www.digikey.com/product-detail/en/torex-semiconductor-ltd/XBS053V15R-G/XBS053V15R-G-ND/2765022?utm_source=snapeda&utm_medium=aggregator&utm_campaign=symbol
P3 = Header 4: Header, 4-Pin; LatestRevisionDate: 17-Jul-2002; LatestRevisionNote: Re-released for DXP Platform.; Publisher: Altium Limited
R3 R10 R13 R15 R16 R18 = Res3: Resistor; Published: 8-Jun-2000; LatestRevisionDate: 29-May-2009; LatestRevisionNote: IPC-7351 Footprint Added.; PackageReference: J1-0603; Publisher: Altium Limited; PackageDescription: Chip Resistor
U6 = SN74LS04D: Hex Inverter; Published: 15-Apr-2002; LatestRevisionDate: 13-Apr-2006; LatestRevisionNote: IPC-7351 Footprint Added.; DatasheetVersion: 1999; PackageReference: 751A-03; Publisher: Altium Limited; PackageDescription: 14-Pin Small Outline Integrated Circuit 1.27 mm Pitch; Code_JEDEC: MS-012-AB; Code_IPC: SOIC127P600-14; ComponentLink1Description: Manufacturer Link; ComponentLink1URL: http://www.onsemi.com/; ComponentLink2Description: Datasheet; ComponentLink2URL: http://www.onsemi.com/pub/Collateral/SN74LS04-D.PDF
U8 = MAX485ESA: Low-Power, Slew-Rate-Limited RS-485/RS-422 Transceiver; Published: 16-Jan-2001; LatestRevisionDate: 13-Apr-2006; LatestRevisionNote: IPC-7351 Footprint Added.; DatasheetVersion: Feb-1996; PackageReference: NSO8; Publisher: Altium Limited; PackageDescription: 8-Pin Small Outline Integrated Circuit 1.27 mm Pitch; Code_JEDEC: MS-012-AA; Code_IPC: SOIC127P600-8; ComponentLink1Description: Manufacturer Link; ComponentLink1URL: http://www.maxim-ic.com/; ComponentLink2Description: Datasheet; ComponentLink2URL: http://pdfserv.maxim-ic.com/en/ds/MAX1487-MAX491.pdf
U9 = MAX3222CAP: 3.0V TO 5.5V, Low-Power, up to 1Mbps, True RS-232 Transceiver Using Four 0.1µF External Capacitor; Published: 16-Jan-2001; LatestRevisionDate: 29-May-2009; LatestRevisionNote: IPC-7351 Footprint Added.; DatasheetVersion: Mar-1999; PackageVersion: 1997; PackageReference: SSOP20; Publisher: Altium Limited; PackageDescription: 20-Pin Small Outline Package 0.65 mm Pitch; Code_JEDEC: MO-150-AE; Code_IPC: SOP65P780-20; ComponentLink1Description: Manufacturer Link; ComponentLink1URL: http://www.maxim-ic.com/; ComponentLink2Description: Datasheet; ComponentLink2URL: http://pdfserv.maxim-ic.com/en/ds/MAX3222-MAX3241.pdf

## Sheet Relay y salida analógica.SchDoc: Relay y lazo 4-20mA
size A4; Address1: Medidor de energia PROSER; Address2: MEI-300V; DocumentNumber: 6; Revision: 01; SheetNumber: 6; SheetTotal: 6
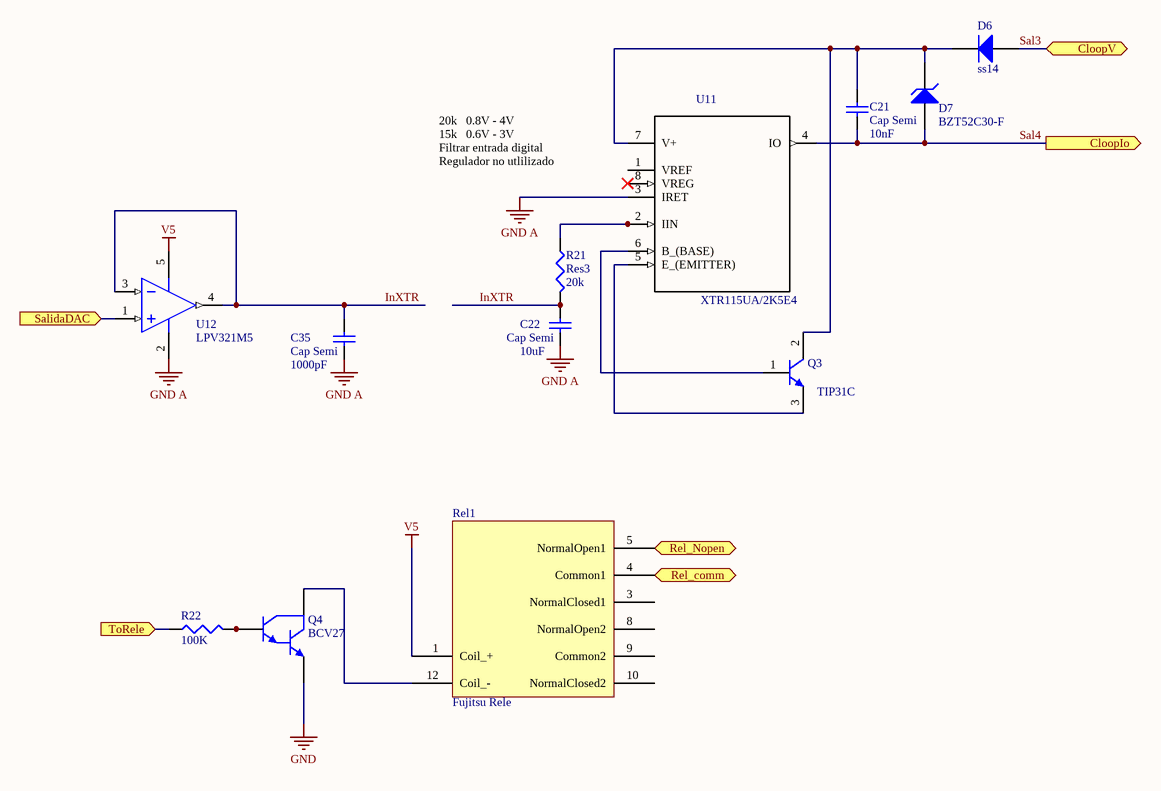
[diagram p5: Relay y salida analógica.SchDoc]

### Parts
C21  Cap Semi  value 10nF  [Custom0805]
C22  Cap Semi  value 10uF  [Custom0805]
C35  Cap Semi  value 1000pF  [Custom0805]
D6  ss14  [DO214]
D7  BZT52C30-F  [1N4148W]
Q3  TIP31C  [TO-220AB]
Q4  BCV27  [SOT23_L]
R21  Res3  value 20k  [Custom0805]
R22  value 100K  [Custom0805]  (hidden comment: Rb)
Rel1  Fujitsu Rele  [Rele_Fujtsu]
U11  XTR115UA/2K5E4  [*SOIC127P600X175-8N]
U12  LPV321M5  [MF05A_N]

### Ports
CloopIo (out), CloopV, Rel_comm (out), Rel_Nopen (out), SalidaDAC (in), ToRele (in)

### Nets
GND: Q4.2(E)
GND A: C22.1 C35.1 U11.3(IRET) U12.2(V-)
V5: Rel1.1(Coil_+) U12.5(V+)
InXTR: C22.2 C35.2 R21.2 U12.3(IN-) U12.4(OUT)
Sal3: D6.1(A) ; port CloopV
Sal4: C21.1 D7.1(A) U11.4(IO) ; port CloopIo
SalidaDAC: U12.1(IN+) ; port SalidaDAC
NetC21_2: C21.2 D6.2(K) D7.2(K) Q3.2(C) U11.7(V+)
NetP1_3: Rel1.4(Common1) ; port Rel_comm
NetP1_4: Rel1.5(NormalOpen1) ; port Rel_Nopen
NetQ3_1: Q3.1(B) U11.6(B_(BASE))
NetQ3_3: Q3.3(E) U11.5(E_(EMITTER))
NetQ4_1: Q4.1(C) Rel1.12(Coil_-)
NetQ4_3: Q4.3(B) R22.2
NetR21_1: R21.1 U11.2(IIN)
NetR22_1: R22.1 ; port ToRele

Not connected (* = marked no-connect by the designer): Rel1 3(NormalClosed1) 8(NormalOpen2) 9(Common2) 10(NormalClosed2); U11 1(VREF) 8(VREG)*

### Notes on the sheet
- 20k   0.8V - 4V
  15k   0.6V - 3V
  Filtrar entrada digital
  Regulador no utlilizado
- Title
- Size:
- Date:
- A4
- Number:
- Time:
- Revision:
- Sheet
- of
- File:

### Library data of the parts
C21 C22 C35 = Cap Semi: Capacitor (Semiconductor SIM Model); Published: 8-Jun-2000; LatestRevisionDate: 29-May-2009; LatestRevisionNote: IPC-7351 Footprint Added.; PackageReference: C1206; Publisher: Altium Limited; PackageDescription: Chip Capacitor
D6 = Diode: Default Diode; Published: 8-Jun-2000; LatestRevisionDate: 17-Jul-2002; LatestRevisionNote: Re-released for DXP Platform.; PackageVersion: Sep-1996; PackageReference: SMC; Publisher: Altium Limited; PackageDescription: DO-214-AB/SMC; 2 C-Bend Leads; Body 7.9 x 5.9 mm, inc. leads (LxW); Code_JEDEC: DO-214-AB
D7 = D Zener: Zener Diode SMD; Published: 8-Jun-2000; LatestRevisionDate: 17-Jul-2002; LatestRevisionNote: Re-released for DXP Platform.; PackageReference: DIODE-0.7; Publisher: Altium Limited; PackageDescription: Diode, Thru-Hole; 2 Leads; 0.7 in Pin Spacing
Q3 = NPN: NPN Bipolar Transistor; Published: 8-Jun-2000; LatestRevisionDate: 17-Jul-2002; LatestRevisionNote: Re-released for DXP Platform.; PackageReference: TO-226-AA; Publisher: Altium Limited; PackageDescription: TO, Flat Index; 3 In-Line, Axial Leads; Body Dia. 4.8mm; Leads 0.55 x 0.51 mm (max); Code_JEDEC: TO-226-AA
Q4 = NPN1: NPN Darlington Bipolar Transistor; Published: 8-Jun-2000; LatestRevisionDate: 17-Jul-2002; LatestRevisionNote: Re-released for DXP Platform.; DatasheetVersion: 1989; PackageVersion: 1989; PackageReference: TO-92; Publisher: Altium Limited; PackageDescription: TO, Flat Index; 3 In-Line, Axial Leads; Body Dia. 4.6mm; Leads 0.41 x 0.39 mm (max); Code_JEDEC: TO-92
R21 R22 = Res3: Resistor; Published: 8-Jun-2000; LatestRevisionDate: 29-May-2009; LatestRevisionNote: IPC-7351 Footprint Added.; PackageReference: J1-0603; Publisher: Altium Limited; PackageDescription: Chip Resistor
Rel1 = Rele_2: FBR12ND-05
U11 = XTR115UA/2K5E4: Current Loop Transmitter 8-Pin SOIC T/R; MF: Texas Instruments; MP: XTR115UA/2K5E4; Price: None; Availability: Unavailable; SnapEDA_Link: https://www.snapeda.com/parts/XTR115UA/2K5E4/Texas%20Instruments/view-part/?ref=snap; Package: None; Value: *
U12 = LPV321M5: General Purpose, Low Voltage, Low Power, Rail-to-Rail Output Operational Amplifiers, 5-pin SOT-23; Manufacturer: National Semiconductor; PackageTopMarking: A27A*XTT; PowerWise: Y; Published: 4-Dec-2008; LatestRevisionDate: 13-Jan-2009; LatestRevisionNote: Sim Model Added.; DatasheetVersion: Oct-2006; PackageVersion: revD, Aug-2008; PackageReference: MF05A; Publisher: Altium Limited; PackageDescription: Molded SOT-23, .115 x .063 x .040 in Body, 5 Lead, .0375 in Pitch; PartNumber: LPV321M5; RoHS: N; PinCount: 5; CompType: Amplifiers; ComponentLink1Description: LPV321 Datasheet; ComponentLink1URL: http://www.national.com/ds/LP/LPV321.pdf; ComponentLink2Description: LPV321 Web Page; ComponentLink2URL: http://www.national.com/pf/LP/LPV321.html; ComponentLink3Description: MF05A Package Page; ComponentLink3URL: http://www.national.com/packaging/folders/mf05a.html

## Nets that join several sheets
ANALOG: CircuitoMedidorADE (10 pins), ParteAnalogicaMedicion (8 pins)
GND: Alimentacion (15 pins), Micro (5 pins), CircuitoMedidorADE (U5.2 U5.7 U5.8), comms (20 pins), Relay y salida analógica (Q4.2)
GND A: Micro (7 pins), Relay y salida analógica (C22.1 C35.1 U11.3 U12.2)
M_GND: Alimentacion (5 pins), CircuitoMedidorADE (12 pins)
M_V3v3: Alimentacion (C26.2 C27.1 U7.10 U7.16), CircuitoMedidorADE (12 pins)
V3v3: Alimentacion (C3.2 U2.2), Micro (6 pins), CircuitoMedidorADE (U5.1), comms (10 pins)
V5: Alimentacion (9 pins), comms (U6.14), Relay y salida analógica (Rel1.1 U12.5)
IAN: CircuitoMedidorADE (U4.6), ParteAnalogicaMedicion (C20.1 R12.1)
IAP: CircuitoMedidorADE (U4.5), ParteAnalogicaMedicion (C19.2 R8.1)
ISL_A: Alimentacion (P2.2), comms (D9.C R10.2 R13.1 U8.6)
ISL_B: Alimentacion (P2.3), comms (D8.C R13.2 R16.1 U8.7)
NetEth1_3: Micro (U3.45), comms (Eth1.3)
NetEth1_4: Micro (U3.47), comms (Eth1.4)
NetEth1_5: Micro (U3.44), comms (Eth1.5)
NetEth1_6: Micro (U3.48), comms (Eth1.6)
NetEth1_10: Micro (U3.49), comms (Eth1.10)
NetEth1_11: Micro (U3.50), comms (Eth1.11)
NetEth1_12: Micro (U3.46), comms (Eth1.12)
NetP1_3: Alimentacion (P1.3), Relay y salida analógica (Rel1.4)
NetP1_4: Alimentacion (P1.4), Relay y salida analógica (Rel1.5)
NetR3_2: Micro (U3.35), comms (R3.2 U8.1 U9.15)
NetR22_1: Micro (U3.29), Relay y salida analógica (R22.1)
NetU3_18: Micro (U3.18), comms (U9.20)
NetU3_19: Micro (U3.19), comms (U9.1)
NetU3_26: Micro (U3.26), comms (U8.2)
NetU3_27: Micro (U3.27), comms (U8.3)
NetU3_30: Micro (U3.30), CircuitoMedidorADE (U5.3)
NetU3_31: Micro (U3.31), CircuitoMedidorADE (U5.5)
NetU3_32: Micro (U3.32), CircuitoMedidorADE (U5.4)
NetU3_33: Micro (U3.33), CircuitoMedidorADE (U5.6)
NetU3_34: Micro (U3.34), comms (U8.4 U9.13)
NetU3_59: Micro (U3.59), comms (U6.1)
NetU3_60: Micro (U3.60), comms (U6.3)
Sal3: Alimentacion (P1.2), Relay y salida analógica (D6.1)
Sal4: Alimentacion (P1.1), Relay y salida analógica (C21.1 D7.1 U11.4)
SalidaDAC: Micro (U3.5), Relay y salida analógica (U12.1)
VN_ADE: CircuitoMedidorADE (U4.11), ParteAnalogicaMedicion (C18.1 R6.1)
VP_ADE: CircuitoMedidorADE (U4.12), ParteAnalogicaMedicion (C15.2 R5.2 R23.2)